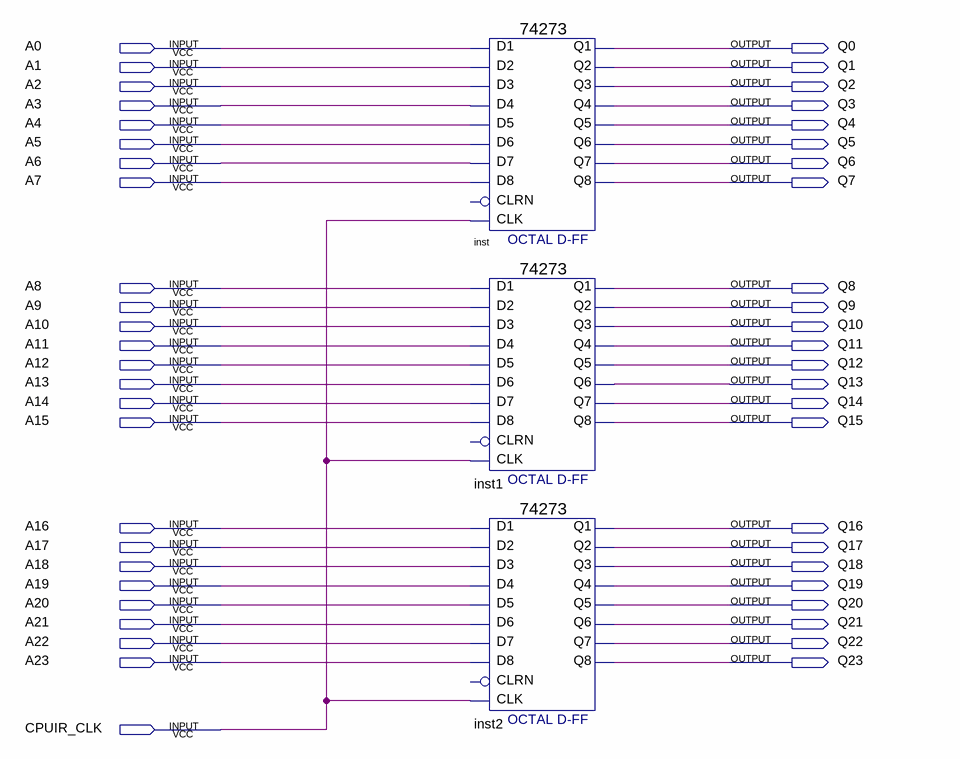
[diagram p0: schematic sheet]
// Quartus schematic CPUIR.bdf as structural Verilog: 3 symbols, 49 pins
module CPUIR (
  input  A0,
  input  A1,
  input  A2,
  input  A3,
  input  A4,
  input  A5,
  input  A6,
  input  A7,
  input  A8,
  input  A9,
  input  A10,
  input  A11,
  input  A12,
  input  A13,
  input  A14,
  input  A15,
  input  A16,
  input  A17,
  input  A18,
  input  A19,
  input  A20,
  input  A21,
  input  A22,
  input  A23,
  input  CPUIR_CLK,
  output Q0,
  output Q1,
  output Q2,
  output Q3,
  output Q4,
  output Q5,
  output Q6,
  output Q7,
  output Q8,
  output Q9,
  output Q10,
  output Q11,
  output Q12,
  output Q13,
  output Q14,
  output Q15,
  output Q16,
  output Q17,
  output Q18,
  output Q19,
  output Q20,
  output Q21,
  output Q22,
  output Q23
);

  \74273  inst (
    .D2(A1), .D3(A2), .D1(A0), .D4(A3), .D7(A6), .D6(A5), .D5(A4), .D8(A7), .CLK(CPUIR_CLK), .Q4(Q3),
    .Q1(Q0), .Q2(Q1), .Q3(Q2), .Q6(Q5), .Q5(Q4), .Q7(Q6), .Q8(Q7));  // open: CLRN
  \74273  inst1 (
    .D2(A9), .D3(A10), .D1(A8), .D4(A11), .D7(A14), .D6(A13), .D5(A12), .D8(A15), .CLK(CPUIR_CLK), .Q4(Q11),
    .Q1(Q8), .Q2(Q9), .Q3(Q10), .Q6(Q13), .Q5(Q12), .Q7(Q14), .Q8(Q15));  // open: CLRN
  \74273  inst2 (
    .D2(A17), .D3(A18), .D1(A16), .D4(A19), .D7(A22), .D6(A21), .D5(A20), .D8(A23), .CLK(CPUIR_CLK),
    .Q4(Q19), .Q1(Q16), .Q2(Q17), .Q3(Q18), .Q6(Q21), .Q5(Q20), .Q7(Q22), .Q8(Q23));  // open: CLRN
endmodule
